# EAGLE schematic transmitter receiver (EAGLE 6.5.0)
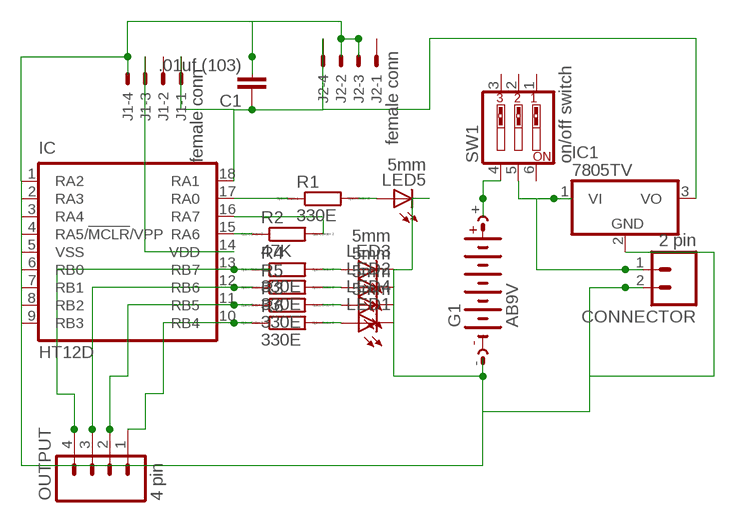
[diagram p0: schematic, sheet 1]

## Parts
C1  .01uf (103)  C2.5/2  [C2.5-2]
CONNECTOR  2 pin  M02  [02P]
G1  AB9V  [AB9V]
IC  HT12D  PIC16F1826/27P  [DIL18]
IC1  7805TV  [TO220V]
J1  female conn  22-05-7048-04  [7395-04]
J2  female conn  22-05-7048-04  [7395-04]
LED1  5mm  LED5MM  [LED5MM]
LED2  5mm  LED5MM  [LED5MM]
LED3  5mm  LED5MM  [LED5MM]
LED4  5mm  LED5MM  [LED5MM]
LED5  5mm  LED5MM  [LED5MM]
OUTPUT  4 pin  M04  [04P]
R1  330E  R0207/10  [0207/10]
R2  47K  R0207/10  [0207/10]
R3  330E  R0207/10  [0207/10]
R4  330E  R0207/10  [0207/10]
R5  330E  R0207/10  [0207/10]
R6  330E  R0207/10  [0207/10]
SW1  on/off switch  SW_DIP-3  [EDG-03]

## Nets
FEMALECONN: IC.14(VDD) J1.3
N$1: LED3.A R4.2
N$2: LED2.A R5.2
N$3: LED4.A R3.2
N$4: LED1.A R6.2
N$5: IC.15(RA6) R2.1
N$6: IC.17(RA0) R1.1
N$7: LED5.A R1.2
N$8: IC.13(RB7) OUTPUT.4 R4.1
N$9: IC.12(RB6) OUTPUT.3 R5.1
N$10: IC.11(RB5) OUTPUT.2 R3.1
N$11: IC.10(RB4) OUTPUT.1 R6.1
N$12: C1.1 IC1.3(VO) IC.18(RA1) J1.1 J2.4
N$15: C1.2 CONNECTOR.2 G1.- IC1.2(GND) IC.1(RA2) IC.2(RA3) IC.3(RA4) IC.4(RA5/!MCLR!/VPP) IC.5(VSS) IC.6(RB0) IC.7(RB1) IC.8(RB2) IC.9(RB3) J1.4 J2.2 J2.3 LED1.K(C) LED2.K(C) LED3.K(C) LED4.K(C) LED5.K(C)
N$16: G1.+ SW1.4
N$17: CONNECTOR.1 IC1.1(VI) SW1.5
N$18: IC.16(RA7) R2.2
Unconnected: J1.2 J2.1 SW1.1 SW1.2 SW1.3 SW1.6

## Library data of the parts
C1 = capacitor-wima:C: CAPACITOR naming: grid - package width
CONNECTOR = con-amp-quick:M02: AMP QUICK CONNECTOR; OC_FARNELL: unknown; OC_NEWARK: unknown
G1 = battery:AB9V: 9-V BATTERY CLIP
IC = microchip:PIC16*F1826/27: 18/20/28-Pin Flash Microcontrollers with nanoWatt XLP Technology Source: www.microchip.com PIC16F1827.pdf
IC1 = linear:78*: Positive VOLTAGE REGULATOR Source: http://cache.national.com/ds/LM/LM78L05.pdf http://www.fairchildsemi.com/ds/LM/LM7805.pdf
J1 J2 = con-molex:22-?-04: CONNECTOR wire to board 2.54 mm (.1 inch) pitch header; OC_FARNELL: unknown; OC_NEWARK: unknown
LED1-LED5 = led:LED: LED OSRAM: - CHIPLED LG R971, LG N971, LY N971, LG Q971, LY Q971, LO R971, LY R971 LH N974, LH R974 LS Q976, LO Q976, LY Q976 LO Q996 - Hyper CHIPLED LW Q18S LB Q993, LB Q99A, LB R99A - SideLED LS A670, LO A670, LY A670, LG A670, LP A670 LB A673, LV A673, LT A673, LW A673 LH A674 LY A675 LS A676, LA A676, LO A676, LY A676, LW A676 LS A679, LY A679, LG A679 - Hyper Micro SIDELED® LS Y876, LA Y876, LO Y876, LY Y876 LT Y87S - SmartLED LW L88C, LW L88S LB L89C, LB L89S, LG L890 LS L89K, LO L89K, LY L89K LS L896, LA L896, LO L896, LY L896 - TOPLED LS T670, LO T670, LY T670, LG T670, LP T670 LSG T670, LSP T670, LSY T670, LOP T670, LYG T670 LG T671, LOG T671, LSG T671 LB T673, LV T673, LT T673, LW T673 LH T674 LS T676, LA T676, LO T676, LY T676, LB T676, LH T676, LSB T676, LW T676 LB T67C, LV T67C, LT T67C, LS T67K, LO T67K, LY T67K, LW E67C LS E67B, LA E67B, LO E67B, LY E67B, LB E67C, LV E67C, LT E67C LW T67C LS T679, LY T679, LG T679 LS T770, LO T770, LY T770, LG T770, LP T770 LB T773, LV T773, LT T773, LW T773 LH T774 LS E675, LA E675, LY E675, LS T675 LS T776, LA T776, LO T776, LY T776, LB T776 LHGB T686 LT T68C, LB T68C - Hyper Mini TOPLED® LB M676 - Mini TOPLED Santana® LG M470 LS M47K, LO M47K, LY M47K Source: http://www.osram.convergy.de LUXEON: - LUMILED® LXK2-PW12-R00, LXK2-PW12-S00, LXK2-PW14-U00, LXK2-PW14-V00 LXK2-PM12-R00, LXK2-PM12-S00, LXK2-PM14-U00 LXK2-PE12-Q00, LXK2-PE12-R00, LXK2-PE12-S00, LXK2-PE14-T00, LXK2-PE14-U00 LXK2-PB12-K00, LXK2-PB12-L00, LXK2-PB12-M00, LXK2-PB14-N00, LXK2-PB14-P00, LXK2-PB14-Q00 LXK2-PR12-L00, LXK2-PR12-M00, LXK2-PR14-Q00, LXK2-PR14-R00 LXK2-PD12-Q00, LXK2-PD12-R00, LXK2-PD12-S00 LXK2-PH12-R00, LXK2-PH12-S00 LXK2-PL12-P00, LXK2-PL12-Q00, LXK2-PL12-R00 Source: www.luxeon.com KINGBRIGHT: KA-3528ASYC Source: www.kingbright.com
OUTPUT = con-amp-quick:M04: AMP QUICK CONNECTOR; OC_FARNELL: unknown; OC_NEWARK: unknown
R1-R6 = eagle-ltspice:R: RESISTOR, European symbol; SPICEMODEL: NONE; SPICEPREFIX: R
SW1 = special:SW_DIP-3: DIP SWITCH